# EAGLE design Motherboard_simple (EAGLE 6.3)
DATABASE: ./../../../eagle/PARTSDB.TXT
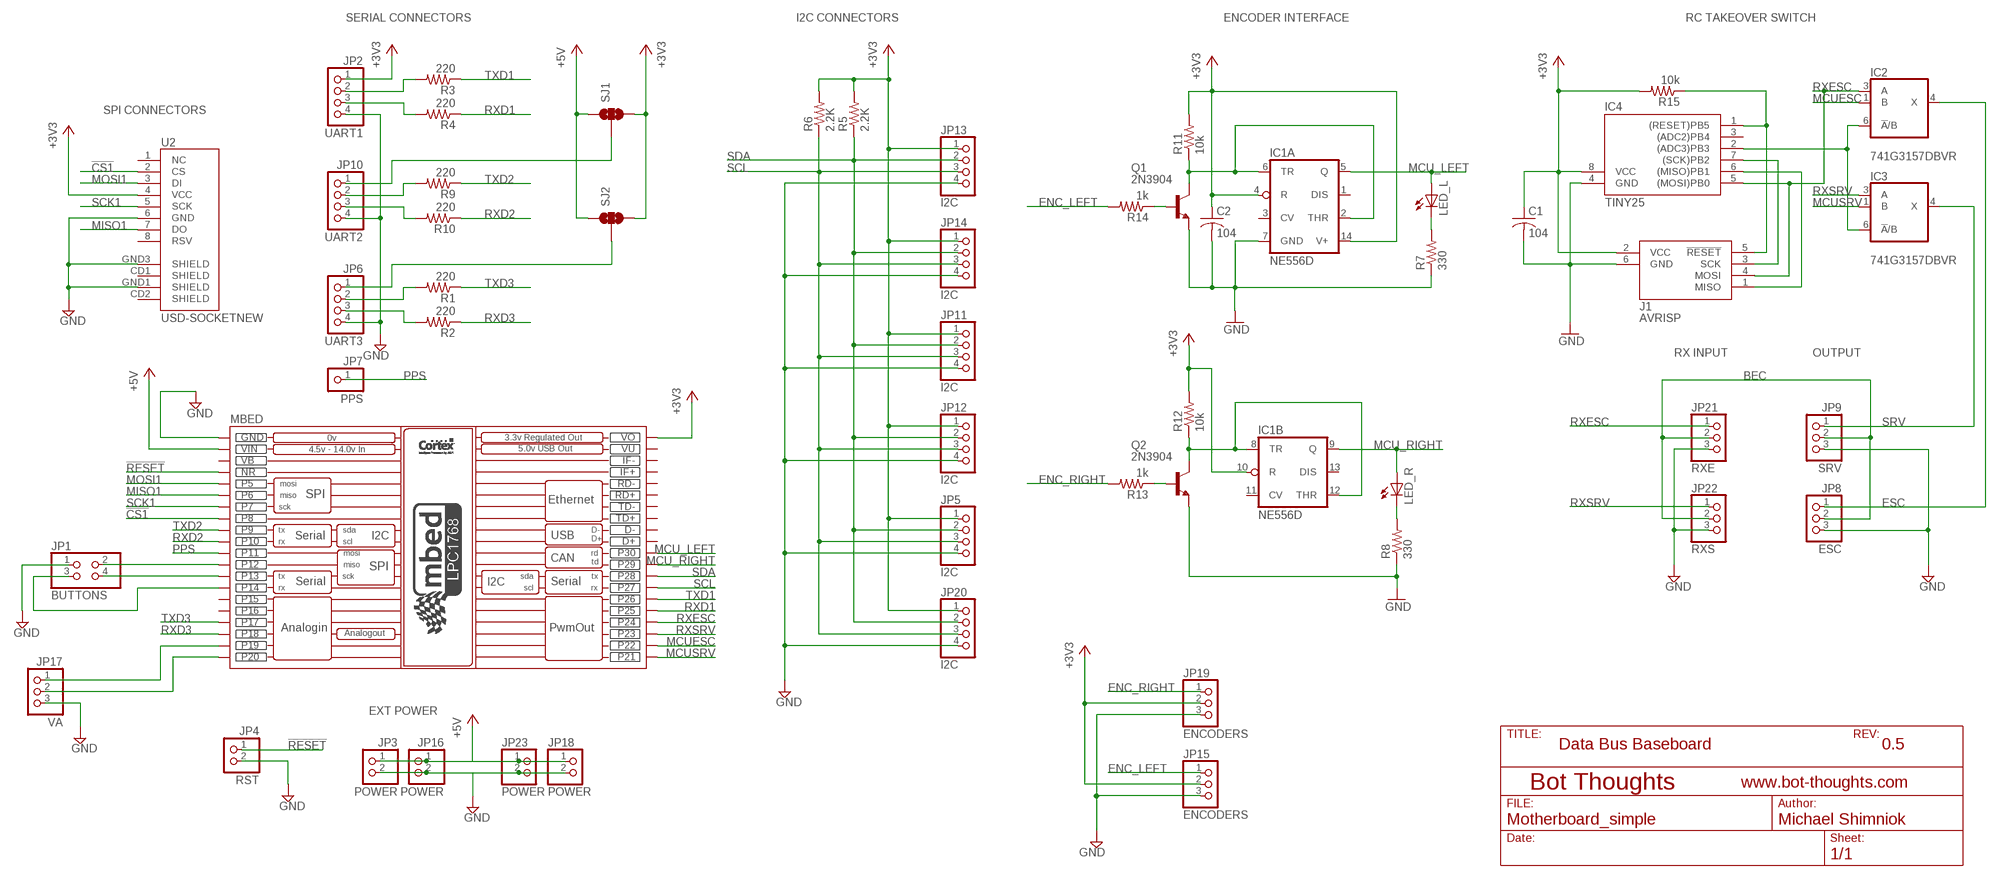
[diagram p0: schematic, sheet 1]

## Parts
C1  104  C-US050-025X075  [C050-025X075]
C2  104  C-US050-025X075  [C050-025X075]
IC1  NE556D  [SO14]
IC2  741G3157DBVR  [DBV_R-PDSO-G6]
IC3  741G3157DBVR  [DBV_R-PDSO-G6]
IC4  TINY25  TINY138P3  [DIL08]
J1  AVRISP  AVRISP6  [CON6P2R]
JP1  BUTTONS  PINHD-2X02_2.54  [2X02]
JP2  UART1  PINHD-1X04_2.54-S  [1X04-S]
JP3  POWER  PINHD-1X02_2.54-S  [1X02-S]
JP4  RST  PINHD-1X02_2.54-S  [1X02-S]
JP5  I2C  PINHD-1X04_2.54-S  [1X04-S]
JP6  UART3  PINHD-1X04_2.54-S  [1X04-S]
JP7  PPS  PINHD-1X01_2.54-S  [1X01-S]
JP8  ESC  PINHD-1X03_2.54-S  [1X03-S]
JP9  SRV  PINHD-1X03_2.54-S  [1X03-S]
JP10  UART2  PINHD-1X04_2.54-S  [1X04-S]
JP11  I2C  PINHD-1X04_2.54-S  [1X04-S]
JP12  I2C  PINHD-1X04_2.54-S  [1X04-S]
JP13  I2C  PINHD-1X04_2.54-S  [1X04-S]
JP14  I2C  PINHD-1X04_2.54-S  [1X04-S]
JP15  ENCODERS  PINHD-1X03_2.54-S  [1X03-S]
JP16  POWER  PINHD-1X02_2.54-S  [1X02-S]
JP17  VA  PINHD-1X03_2.54-S  [1X03-S]
JP18  POWER  PINHD-1X02_2.54-S  [1X02-S]
JP19  ENCODERS  PINHD-1X03_2.54-S  [1X03-S]
JP20  I2C  PINHD-1X04_2.54-S  [1X04-S]
JP21  RXE  PINHD-1X03_2.54-S  [1X03-S]
JP22  RXS  PINHD-1X03_2.54-S  [1X03-S]
JP23  POWER  PINHD-1X02_2.54-S  [1X02-S]
LED_L  LED3MM  [LED3MM]
LED_R  LED3MM  [LED3MM]
MBED  MBED_NXP_LPC1768  [MBED-KIT]
Q1  2N3904  [TO92]
Q2  2N3904  [TO92]
R1  220  R-US_0204/5  [0204/5]
R2  220  R-US_0204/5  [0204/5]
R3  220  R-US_0204/5  [0204/5]
R4  220  R-US_0204/5  [0204/5]
R5  2.2K  R-US_0204/5  [0204/5]
R6  2.2K  R-US_0204/5  [0204/5]
R7  330  R-US_0204/5  [0204/5]
R8  330  R-US_0204/5  [0204/5]
R9  220  R-US_0204/5  [0204/5]
R10  220  R-US_0204/5  [0204/5]
R11  10k  R-US_0204/5  [0204/5]
R12  10k  R-US_0204/5  [0204/5]
R13  1k  R-US_0204/5  [0204/5]
R14  1k  R-US_0204/5  [0204/5]
R15  10k  R-US_0204/5  [0204/5]
SJ1  SOLDERJUMPER_2WAYS  [SJ_3]
SJ2  SOLDERJUMPER_2WAYS  [SJ_3]
U2  USD-SOCKETNEW  [MICRO-SD-SOCKET-PP]

## Nets
!CS1: MBED.P$8(P8) U2.2(CS)
!RESET: JP4.1 MBED.NR
!TRST: IC4.1((RESET)PB5) J1.5(!RESET) R15.1
+3V3: C1.1 C2.1 IC1.4(A:R) IC1.10(B:R) IC1.14(A:V+) IC4.8(VCC) J1.2(VCC) JP2.1 JP5.1 JP11.1 JP12.1 JP13.1 JP14.1 JP15.2 JP19.2 JP20.1 MBED.VOUT(VO) R5.2 R6.2 R11.2 R12.2 R15.2 SJ1.3 SJ2.3 U2.4(VCC)
+5V: JP3.1 JP16.1 JP18.1 JP23.1 MBED.VIN SJ1.1 SJ2.1
AMP: JP17.2 MBED.P$20(P20)
BEC: JP8.2 JP9.2 JP21.2 JP22.2
ENC_LEFT: JP15.1 R14.2
ENC_RIGHT: JP19.1 R13.2
ESC: IC2.4(X) JP8.1
GND: C1.2 C2.2 IC1.7(A:GND) IC4.4(GND) J1.6(GND) JP1.1 JP2.4 JP3.2 JP4.2 JP5.4 JP6.4 JP8.3 JP9.3 JP10.4 JP11.4 JP12.4 JP13.4 JP14.4 JP15.3 JP16.2 JP17.3 JP18.2 JP19.3 JP20.4 JP21.3 JP22.3 JP23.2 MBED.GND Q1.3(E) Q2.3(E) R7.1 R8.1 U2.6(GND) U2.GND1(SHIELD) U2.GND3(SHIELD)
MCU_LEFT: IC1.5(A:Q) LED_L.A MBED.P$30(P30)
MCU_RIGHT: IC1.9(B:Q) LED_R.A MBED.P$29(P29)
MCUESC: IC2.1(B) MBED.P$22(P22)
MCUSRV: IC3.1(B) MBED.P$21(P21)
MISO: IC4.6((MISO)PB1) J1.1(MISO)
MISO1: MBED.P$6(P6) U2.7(DO)
MOSI1: MBED.P$5(P5) U2.3(DI)
N$1: JP6.2 R1.2
N$2: JP6.3 R2.2
N$3: LED_L.K(C) R7.2
N$4: LED_R.K(C) R8.2
N$5: JP1.4 MBED.P$13(P13)
N$6: JP17.1 MBED.P$19(P19)
N$7: JP1.2 MBED.P$12(P12)
N$8: JP1.3 MBED.P$14(P14)
N$9: JP2.2 R3.2
N$10: JP2.3 R4.2
N$11: IC1.8(B:TR) IC1.12(B:THR) Q2.1(C) R12.1
N$12: IC1.2(A:THR) IC1.6(A:TR) Q1.1(C) R11.1
N$13: Q2.2(B) R13.1
N$14: Q1.2(B) R14.1
N$16: JP10.2 R9.2
N$17: JP10.3 R10.2
N$18: JP10.1 SJ1.2
N$19: JP6.1 SJ2.2
N$25: IC2.6(!A!/B) IC3.6(!A!/B) IC4.2((ADC3)PB3)
PPS: JP7.1 MBED.P$11(P11)
RXD1: MBED.P$25(P25) R4.1
RXD2: MBED.P$10(P10) R10.1
RXD3: MBED.P$18(P18) R2.1
RXESC: IC2.3(A) IC4.5((MOSI)PB0) J1.4(MOSI) JP21.1 MBED.P$24(P24)
RXSRV: IC3.3(A) JP22.1 MBED.P$23(P23)
SCK: IC4.7((SCK)PB2) J1.3(SCK)
SCK1: MBED.P$7(P7) U2.5(SCK)
SCL: JP5.3 JP11.3 JP12.3 JP13.3 JP14.3 JP20.3 MBED.P$27(P27) R6.1
SDA: JP5.2 JP11.2 JP12.2 JP13.2 JP14.2 JP20.2 MBED.P$28(P28) R5.1
SRV: IC3.4(X) JP9.1
TXD1: MBED.P$26(P26) R3.1
TXD2: MBED.P$9(P9) R9.1
TXD3: MBED.P$17(P17) R1.1
Unconnected: IC1.1(A:DIS) IC1.3(A:CV) IC1.11(B:CV) IC1.13(B:DIS) IC4.3((ADC2)PB4) MBED.D+ MBED.D- MBED.IF+ MBED.IF- MBED.P$15(P15) MBED.P$16(P16) MBED.RD+ MBED.RD- MBED.TD+ MBED.TD- U2.1(NC) U2.8(RSV) U2.CD1(SHIELD) U2.CD2(SHIELD)

## Notes on the sheet
- SERIAL CONNECTORS | I2C CONNECTORS | ENCODER INTERFACE | RC TAKEOVER SWITCH
- SPI CONNECTORS
- RX INPUT | OUTPUT
- EXT POWER
- Data Bus Baseboard | 0.5

## Power pins joined to a net without a drawn wire
GND: IC2.2(GND) IC3.2(GND)
VB: MBED.VB
VCC: IC2.5(VCC) IC3.5(VCC)
VU: MBED.VU

## Library data of the parts
C1 C2 = rcl:C-US: CAPACITOR, American symbol
IC1 = linear:*556: Dual TIMER
IC2 IC3 = 74xx-little-us:74*1G3157: Single-Pole, Double-Throw Analog Switch Source: http://focus.ti.com/lit/ds/symlink/sn74lvc1g3157.pdf
IC4 = avr-7:TINY13*
J1 = ads4:AVRISP6: 6-pin dual-row connector for Atmel AVRISP programmer interface
JP1 = pinhead-2:PINHD-2X02: PIN HEADER
JP2 JP5 JP6 JP10-JP14 JP20 = pinhead-2:PINHD-1X04: PIN HEADER; OC_NEWARK: unknown
JP3 JP4 JP16 JP18 JP23 = pinhead-2:PINHD-1X02: PIN HEADER; OC_NEWARK: unknown
JP7 = pinhead-2:PINHD-1X01: PIN HEADER
JP8 JP9 JP15 JP17 JP19 JP21 JP22 = pinhead-2:PINHD-1X03: PIN HEADER; OC_NEWARK: unknown
LED_L LED_R = led:LED: LED OSRAM: - CHIPLED LG R971, LG N971, LY N971, LG Q971, LY Q971, LO R971, LY R971 LH N974, LH R974 LS Q976, LO Q976, LY Q976 LO Q996 - Hyper CHIPLED LW Q18S LB Q993, LB Q99A, LB R99A - SideLED LS A670, LO A670, LY A670, LG A670, LP A670 LB A673, LV A673, LT A673, LW A673 LH A674 LY A675 LS A676, LA A676, LO A676, LY A676, LW A676 LS A679, LY A679, LG A679 - Hyper Micro SIDELED® LS Y876, LA Y876, LO Y876, LY Y876 LT Y87S - SmartLED LW L88C, LW L88S LB L89C, LB L89S, LG L890 LS L89K, LO L89K, LY L89K LS L896, LA L896, LO L896, LY L896 - TOPLED LS T670, LO T670, LY T670, LG T670, LP T670 LSG T670, LSP T670, LSY T670, LOP T670, LYG T670 LG T671, LOG T671, LSG T671 LB T673, LV T673, LT T673, LW T673 LH T674 LS T676, LA T676, LO T676, LY T676, LB T676, LH T676, LSB T676, LW T676 LB T67C, LV T67C, LT T67C, LS T67K, LO T67K, LY T67K, LW E67C LS E67B, LA E67B, LO E67B, LY E67B, LB E67C, LV E67C, LT E67C LW T67C LS T679, LY T679, LG T679 LS T770, LO T770, LY T770, LG T770, LP T770 LB T773, LV T773, LT T773, LW T773 LH T774 LS E675, LA E675, LY E675, LS T675 LS T776, LA T776, LO T776, LY T776, LB T776 LHGB T686 LT T68C, LB T68C - Hyper Mini TOPLED® LB M676 - Mini TOPLED Santana® LG M470 LS M47K, LO M47K, LY M47K Source: http://www.osram.convergy.de LUXEON: - LUMILED® LXK2-PW12-R00, LXK2-PW12-S00, LXK2-PW14-U00, LXK2-PW14-V00 LXK2-PM12-R00, LXK2-PM12-S00, LXK2-PM14-U00 LXK2-PE12-Q00, LXK2-PE12-R00, LXK2-PE12-S00, LXK2-PE14-T00, LXK2-PE14-U00 LXK2-PB12-K00, LXK2-PB12-L00, LXK2-PB12-M00, LXK2-PB14-N00, LXK2-PB14-P00, LXK2-PB14-Q00 LXK2-PR12-L00, LXK2-PR12-M00, LXK2-PR14-Q00, LXK2-PR14-R00 LXK2-PD12-Q00, LXK2-PD12-R00, LXK2-PD12-S00 LXK2-PH12-R00, LXK2-PH12-S00 LXK2-PL12-P00, LXK2-PL12-Q00, LXK2-PL12-R00 Source: www.luxeon.com KINGBRIGHT: KA-3528ASYC Source: www.kingbright.com
MBED = MBED_v2.1:MBED_NXP_LPC1768: Mbed LPC1768 - ARM CORTEX v2.1 * Schematic symbol is now placed in eagles's default raster. *The pads diameter are suitable for routing between mbed pins * mbed pads are 0.8 mm drill diameter. --------------------------------------------- Created by: Mohamed Yousry *Alexandria, Egypt *Email: mohamed.yousry@ieeegoldegypt.org; MPN: 2212S-20SG-85; OC_NEWARK: 08N6778
Q1 Q2 = mes_transistors:2N3904: NPN Transistor Small signal NPN Bipolar Junction Transistor (BJT). Use this device to represent any of a number of such transistors with similar package and pinout: 2N4401, 2N3904, 2N2222, etc.
R1-R4 R9 R10 = rcl:R-US_: RESISTOR, American symbol; MPN: WCR0805-220RFI; OC_NEWARK: 98K2621
R5 R6 = rcl:R-US_: RESISTOR, American symbol; OC_NEWARK: unknown
R7 R8 R11-R15 = rcl:R-US_: RESISTOR, American symbol
SJ1 SJ2 = SparkFun:SOLDERJUMPER_2WAY: Solder Jumper 2 way solder jumper
U2 = SparkFun:USD-SOCKET: microSD Socket Push-push type uSD socket. Schematic element and footprint production proven. Spark Fun Electronics SKU : PRT-00127. tDoc lines correctly indicate media card edge positions when inserting (unlocked, locked, depressed).

## Board
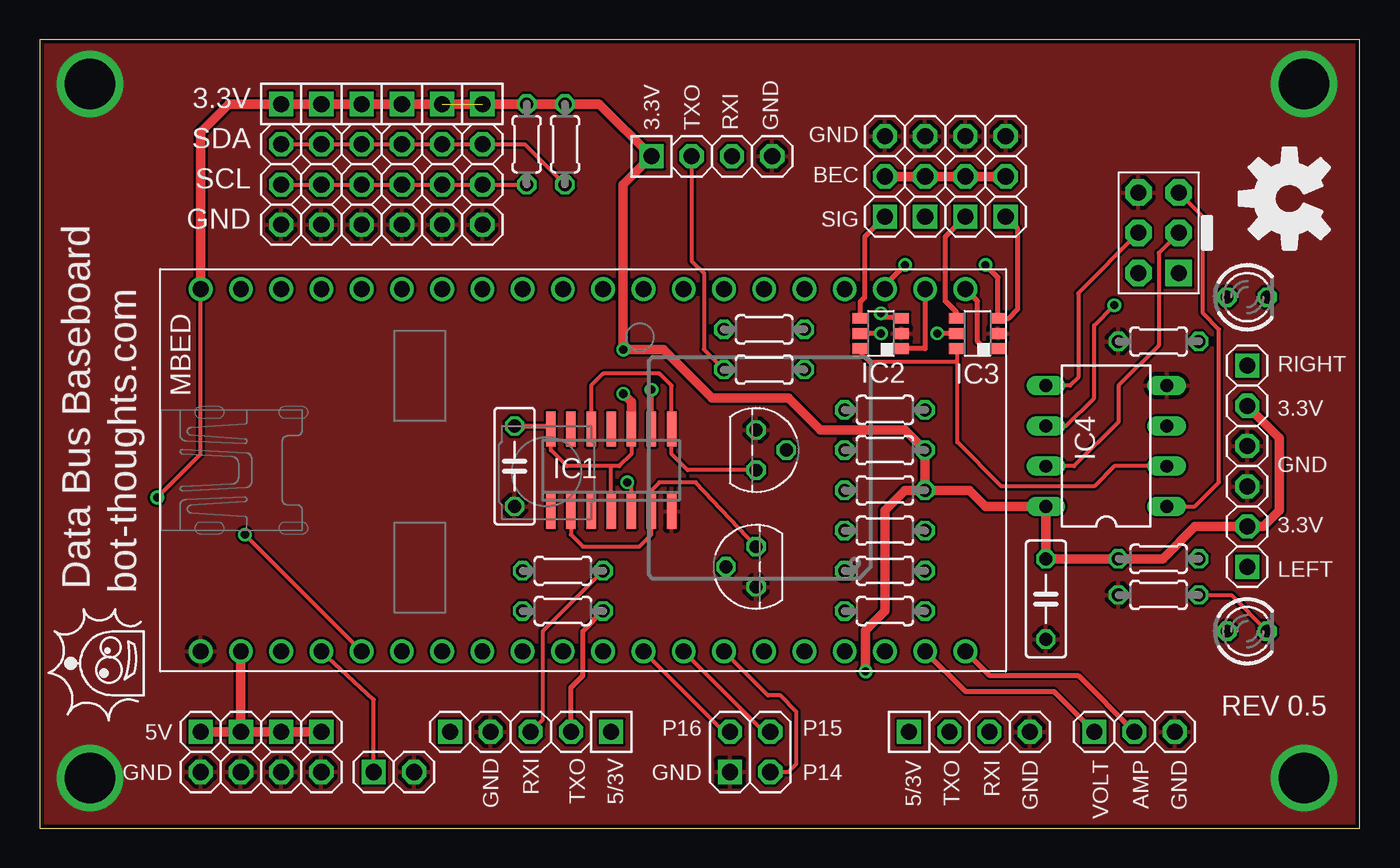
[diagram p1: board, top side]
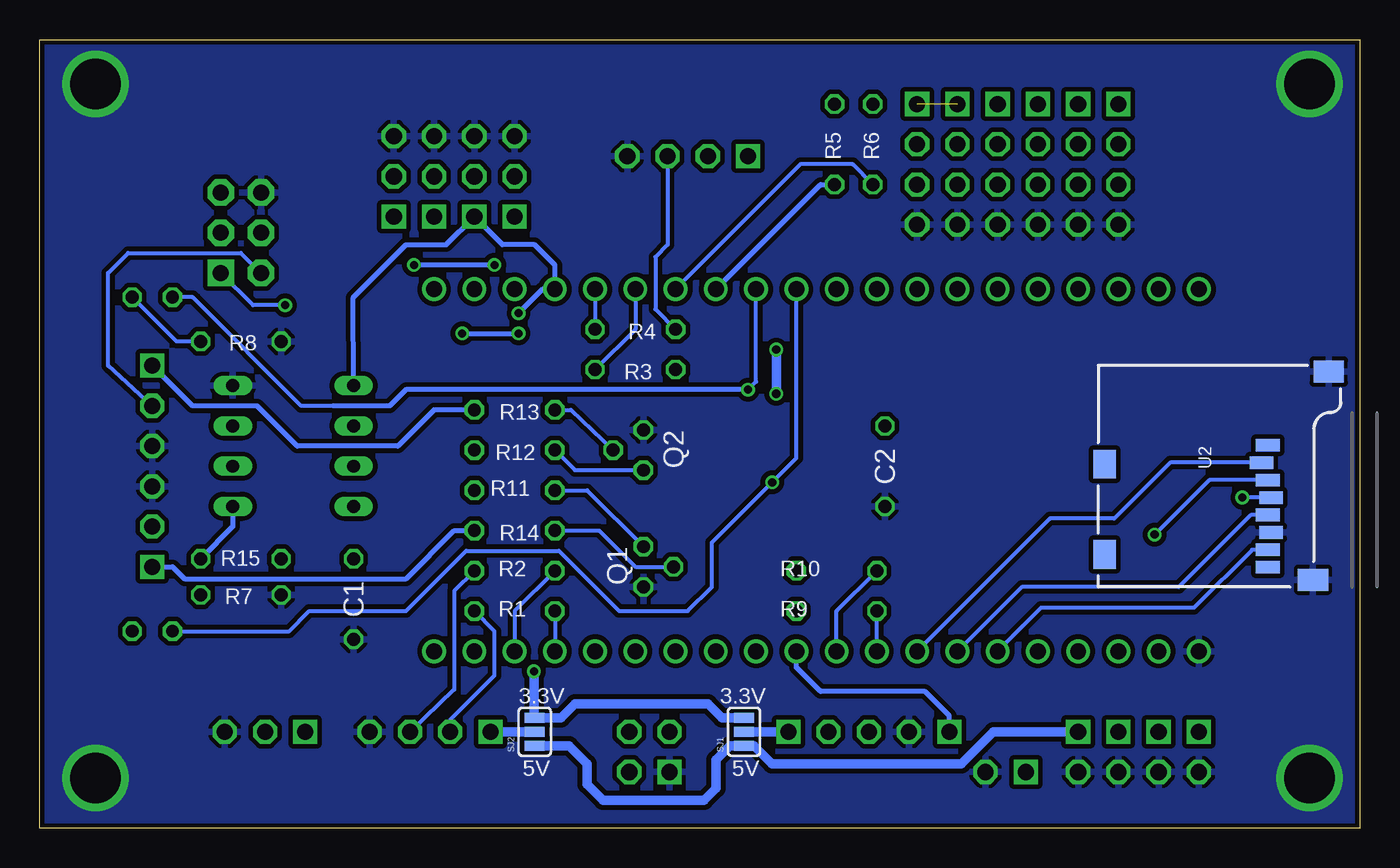
[diagram p2: board, bottom side, seen from below]

Size 83.31 x 49.78 mm. Coordinates in mm from the lower left corner, seen from the top.
Outline: 0,0 83.31,0 83.31,49.78 0,49.78 0,0
Copper layers (1*16): Top 0.0356mm / dielectric 1.5011mm / Bottom 0.0356mm
Design rules "default *": minimum track width 6mil, minimum drill 13mil, track to track 6mil, track to pad 6mil, pad to pad 6mil, via to via 6mil, smd to smd 6mil, copper to edge 10mil, drill to drill 6mil, minimum pad ring 7mil, minimum via ring 7mil, stop-mask expansion 4mil, vias tented up to drill 21mil, thermal gap 10mil

### Footprints (pad centres in the part's own frame; a part is rotated, then mirrored left to right if it is on the bottom)
C050-025X075 = drill 0.813 octagon: 1 -2.54,0; 2 2.54,0
SO14 = smd 0.6 x 2.2: 1 -3.81,-2.6; 2 -2.54,-2.6; 3 -1.27,-2.6; 4 0,-2.6; 5 1.27,-2.6; 6 2.54,-2.6; 7 3.81,-2.6; 8 3.81,2.6; 9 2.54,2.6; 10 1.27,2.6; 11 0,2.6; 12 -1.27,2.6; 13 -2.54,2.6; 14 -3.81,2.6
DBV_R-PDSO-G6 = smd 0.69 x 0.99: 1 -0.95,-1.29; 2 0,-1.29; 3 0.95,-1.29; 4 0.95,1.3; 5 0,1.3; 6 -0.95,1.3
DIL08 = drill 0.813 long: 1 -3.81,-3.81; 2 -1.27,-3.81; 3 1.27,-3.81; 4 3.81,-3.81; 5 3.81,3.81; 6 1.27,3.81; 7 -1.27,3.81; 8 -3.81,3.81
CON6P2R = drill 1.016 pad 1.676 square: 1 -2.54,-1.27 | drill 1.016 pad 1.676 octagon: 2 -2.54,1.27; 3 0,-1.27; 4 0,1.27; 5 2.54,-1.27; 6 2.54,1.27
2X02 = drill 1.016 square: 1 -1.27,-1.27 | drill 1.016 octagon: 2 -1.27,1.27; 3 1.27,-1.27; 4 1.27,1.27
1X04-S = drill 1.016 square: 1 -3.81,0 | drill 1.016 octagon: 2 -1.27,0; 3 1.27,0; 4 3.81,0
1X02-S = drill 1.016 square: 1 -1.27,0 | drill 1.016 octagon: 2 1.27,0
1X01-S = drill 1.016 square: 1 0,0
1X03-S = drill 1.016 square: 1 -2.54,0 | drill 1.016 octagon: 2 0,0; 3 2.54,0
LED3MM = drill 0.813 octagon: A -1.27,0; K 1.27,0
MBED-KIT = drill 1: D+ 11.43,1.27; D- 11.43,3.81; GND -11.43,24.13; IF+ 11.43,16.51; IF- 11.43,19.05; NR -11.43,16.51; P$5 -11.43,13.97; P$6 -11.43,11.43; P$7 -11.43,8.89; P$8 -11.43,6.35; P$9 -11.43,3.81; P$10 -11.43,1.27; P$11 -11.43,-1.27; P$12 -11.43,-3.81; P$13 -11.43,-6.35; P$14 -11.43,-8.89; P$15 -11.43,-11.43; P$16 -11.43,-13.97; P$17 -11.43,-16.51; P$18 -11.43,-19.05; P$19 -11.43,-21.59; P$20 -11.43,-24.13; P$21 11.43,-24.13; P$22 11.43,-21.59; P$23 11.43,-19.05; P$24 11.43,-16.51; P$25 11.43,-13.97; P$26 11.43,-11.43; P$27 11.43,-8.89; P$28 11.43,-6.35; P$29 11.43,-3.81; P$30 11.43,-1.27; RD+ 11.43,11.43; RD- 11.43,13.97; TD+ 11.43,6.35; TD- 11.43,8.89; VB -11.43,19.05; VIN -11.43,21.59; VOUT 11.43,24.13; VU 11.43,21.59
TO92 = drill 0.813 octagon: 1 1.27,0; 2 0,1.905; 3 -1.27,0
0204/5 = drill 0.813 octagon: 1 -2.54,0; 2 2.54,0
SJ_3 = smd 0.635 x 1.27: 1 -0.889,0; 2 0,0; 3 0.889,0
MICRO-SD-SOCKET-PP = smd 0.8 x 1.5: 1 -8.94,10.7; 2 -7.84,10.3; 3 -6.74,10.7; 4 -5.64,10.9; 5 -4.54,10.7; 6 -3.44,10.9; 7 -2.34,10.7; 8 -1.24,10.7 | smd 1.8 x 1.4: CD1 -2.05,0.4; CD2 -7.75,0.4 | smd 1.4 x 1.9: GND1 -13.6,14.55; GND3 -0.45,13.55

### Placement (x,y rotation side)
C1  63.5,14.48 270 top
C2  29.97,22.86 270 top
IC1  36.07,22.61 0 top
IC2  53.09,31.24 90 top
IC3  59.18,31.24 90 top
IC4  67.31,24.13 90 top
J1  70.61,37.59 90 top
JP1  44.83,4.83 0 top
JP2  42.42,42.42 0 top
JP3  15.24,4.83 270 top
JP4  22.35,3.56 0 top
JP5  25.4,41.91 270 top
JP6  58.67,6.1 0 top
JP7  25.91,6.1 270 top
JP8  53.34,41.15 90 top
JP9  58.42,41.15 90 top
JP10  32.26,6.1 180 top
JP11  20.32,41.91 270 top
JP12  15.24,41.91 270 top
JP13  22.86,41.91 270 top
JP14  17.78,41.91 270 top
JP15  76.2,19.05 90 top
JP16  12.7,4.83 270 top
JP17  69.09,6.1 0 top
JP18  10.16,4.83 270 top
JP19  76.2,26.67 270 top
JP20  27.94,41.91 270 top
JP21  55.88,41.15 90 top
JP22  60.96,41.15 90 top
JP23  17.78,4.83 270 top
LED_L  76.2,12.45 0 top
LED_R  76.2,33.53 0 top
MBED  34.29,22.61 90 top
Q1  45.21,16.51 90 top
Q2  45.21,23.88 270 top
R1  53.34,13.72 0 top
R2  53.34,16.26 0 top
R3  45.72,28.96 180 top
R4  45.72,31.5 180 top
R5  33.15,43.18 90 top
R6  30.73,43.18 90 top
R7  70.61,14.73 0 top
R8  70.61,30.73 0 top
R9  33.02,13.72 0 top
R10  33.02,16.26 0 top
R11  53.34,21.34 0 top
R12  53.34,23.88 0 top
R13  53.34,26.42 0 top
R14  53.34,18.8 0 top
R15  70.61,17.02 180 top
SJ1  38.86,6.1 90 bottom
SJ2  52.07,6.1 90 bottom
U2  16.51,15.24 270 bottom

### Tracks (layer width: path | path; a pad name or v marks a point on that pad's centre or on a via)
!CS1
  Bottom 0.254: U2.2 11.97,23.08 15.49,19.56 19.56,19.56 MBED.P$8
!RESET
  Top 0.254: JP4.1 21.08,8.13 MBED.NR
!TRST
  Top 0.254: IC4.1 72.9,20.32 74.42,21.84 74.42,31.5 73.41,32.51 73.41,38.61 J1.5
  Bottom 0.305: IC4.1 71.12,19.05 R15.1
+3V3  (via drill 0.51)  (1 unrouted)
  Top 0.254: v7.42,20.88 10.16,23.62 MBED.VOUT | IC1.4 36.07,22.86 | 36.07,22.86 33.27,22.86 32.26,23.88 IC1.14 | IC1.10 37.34,23.62 36.58,22.86 36.07,22.86
  Top 0.305: C2.1 32.06,25.4 IC1.14
  Top 0.61: MBED.VOUT 10.16,43.94 11.94,45.72 JP12.1 JP14.1 JP11.1 JP13.1 JP5.1 R6.2 R5.2 35.31,45.72 JP2.1 36.83,40.64 v36.83,30.23 39.37,30.23 42.42,27.18 47.24,27.18 49.28,25.15 54.61,25.15 R12.2 R11.2 | R11.2 54.61,21.34 53.34,20.07 53.34,13.72 52.12,12.5 v52.12,9.91 | IC1.10 37.34,26.92 v36.83,27.43 | R11.2 58.67,21.34 59.69,20.32 IC4.8 C1.1 R15.2 70.87,17.02 72.9,19.05 JP15.2 77.22,19.05 78.23,20.07 78.23,24.64 JP19.2
  Bottom 0.254: U2.4 v7.42,20.88 | JP19.2 78.99,29.21 78.99,35.05 77.72,36.32 70.61,36.32 J1.2
  Bottom 0.61: v36.83,27.43 v36.83,30.23 | SJ1.3 40.26,6.99 41.15,7.87 49.53,7.87 50.42,6.99 SJ2.3 | SJ2.3 51.94,6.99 | v52.12,9.91 52.12,7.04 SJ2.3
+5V
  Top 0.61: JP16.1 MBED.VIN | JP16.1 JP3.1 JP23.1 | JP16.1 JP18.1
  Bottom 0.61: SJ2.1 49.91,5.21 48.77,4.06 48.77,2.79 47.75,1.78 41.4,1.78 40.64,2.54 40.64,4.32 39.75,5.21 SJ1.1 38.23,5.21 37.08,4.06 25.15,4.06 23.11,6.1 JP23.1
AMP
  Top 0.305: MBED.P$20 59.94,9.65 65.53,9.65 JP17.2
BEC
  Top 0.61: JP8.2 JP21.2 JP9.2 JP22.2
ENC_LEFT
  Bottom 0.305: JP15.1 74.93,16.51 74.17,15.75 60.2,15.75 57.15,18.8 R14.2
ENC_RIGHT
  Bottom 0.305: R13.2 58.42,26.42 60.71,24.13 67.06,24.13 69.6,26.67 73.66,26.67 JP19.1
ESC
  Top 0.305: IC2.4 51.79,33.24 52.07,33.53 52.07,37.34 JP8.1
GND  (via drill 3.17)
  other vias: 3.17,46.99 3.17,3.17 79.78,3.17 79.78,46.99
  pour Bottom (isolate 0.305, rank 3): 0,49.91 83.34,49.91 83.34,0 0,0
  pour Top: 0,50.04 83.31,50.04 83.31,0 0,0
MCU_LEFT  (via drill 0.51)
  Top 0.254: IC1.5 37.34,21.59 v37.08,21.84
  Bottom 0.254: MBED.P$30 35.56,23.37 v37.08,21.84 40.89,18.03 40.89,15.24 42.42,13.72 46.74,13.72 50.55,17.53 56.39,17.53 60.2,13.72 66.29,13.72 67.56,12.45 LED_L.A
MCU_RIGHT  (via drill 0.51)
  Top 0.254: v38.61,27.69 IC1.9
  Bottom 0.254: v38.61,27.69 38.1,28.19 MBED.P$29 | 64.77,26.67 66.8,26.67 73.66,33.53 LED_R.A
  Bottom 0.305: v38.61,27.69 60.2,27.69 61.21,26.67 64.77,26.67
MCUESC
  Top 0.305: MBED.P$22 55.88,30.27 IC2.1
MCUSRV
  Top 0.305: IC3.1 59.62,30.29 59.18,30.73 59.18,33.27 MBED.P$21
MISO  (via drill 0.51)
  Top 0.254: IC4.6 64.77,25.4 66.55,27.18 66.55,31.75 v67.82,33.02
  Bottom 0.254: v67.82,33.02 69.85,33.02 J1.1
MISO1
  Bottom 0.254: U2.7 6.8,17.58 10.47,13.92 20.12,13.92 MBED.P$6
MOSI1  (via drill 0.51)
  Top 0.254: v12.95,18.54 MBED.P$5
  Bottom 0.254: U2.3 9.52,21.98 v12.95,18.54
N$1
  Bottom 0.254: JP6.2 57.4,6.86 54.61,9.65 54.61,12.45 R1.2
N$2
  Bottom 0.254: R2.2 57.15,14.99 57.15,8.76 JP6.3
N$3
  Top 0.254: R7.2 75.18,14.73 LED_L.K
N$4
  Bottom 0.254: R8.2 74.68,30.73 LED_R.K
N$5
  Top 0.254: JP1.4 45.72,6.1 MBED.P$13
N$6
  Top 0.305: MBED.P$19 58.42,8.64 64.01,8.64 JP17.1
N$7
  Top 0.254: JP1.2 43.18,6.1 MBED.P$12
N$8
  Top 0.254: JP1.3 47.24,3.56 47.75,4.06 47.75,7.37 46.74,8.38 45.97,8.38 MBED.P$14
N$9
  Top 0.254: JP2.2 41.15,35.81 41.91,35.05 41.91,30.23 R3.2
N$10
  Bottom 0.254: JP2.3 43.69,36.83 44.45,36.07 44.45,32.77 R4.2
N$11
  Top 0.254: Q2.1 40.89,22.61 39.88,23.62 IC1.8 39.88,27.94 39.12,28.7 35.56,28.7 34.8,27.94 IC1.12
  Bottom 0.254: R12.1 49.53,22.61 Q2.1
N$12
  Top 0.254: Q1.1 41.4,21.84 39.12,21.84 38.61,21.34 IC1.6 38.61,18.54 37.85,17.78 34.29,17.78 33.53,18.54 IC1.2
  Bottom 0.254: R11.1 48.77,21.34 Q1.1
N$13
  Bottom 0.254: R13.1 49.78,26.42 Q2.2
N$14
  Bottom 0.254: R14.1 48.01,18.8 45.72,16.51 Q1.2
N$16
  Top 0.305: JP10.2 33.53,8.89 34.29,9.65 34.29,12.45 R9.2
N$17
  Top 0.254: R10.2 31.75,12.45 31.75,6.86 JP10.3
N$18
  Bottom 0.61: SJ1.2 JP10.1
N$19
  Bottom 0.61: SJ2.2 JP6.1
N$25
  Top 0.254: IC4.2 67.82,22.86 66.55,21.59 60.71,21.59 57.91,24.38 57.91,29.46 | 57.91,29.46 57.91,30.26 IC3.6 | IC2.6 51.79,30 52.32,29.46 57.91,29.46
PPS
  Bottom 0.305: JP7.1 25.91,7.11 27.43,8.64 34.04,8.64 35.56,10.16 MBED.P$11
RXD1
  Bottom 0.254: MBED.P$25 R4.1
RXD2
  Bottom 0.254: MBED.P$10 33.02,13.72 R10.1
RXD3
  Bottom 0.254: R2.1 53.34,13.72 MBED.P$18
RXESC  (via drill 0.51)
  Top 0.254: J1.4 65.53,33.78 65.53,28.45 65.02,27.94 IC4.5
  Top 0.305: v53.09,32.51 53.34,32.26 54.31,32.26 IC2.3
  Bottom 0.305: v53.09,32.51 51.56,34.04 MBED.P$24 50.8,35.56 52.07,36.83 54.1,36.83 JP21.1 57.66,36.83 60.2,36.83 63.53,33.5 IC4.5
RXSRV  (via drill 0.51)
  Top 0.305: JP22.1 61.72,37.85 61.72,32.77 61.15,32.19 IC3.3 60.47,34.78 v59.69,35.56 | MBED.P$23 53.34,34.29 v54.61,35.56
  Bottom 0.305: v54.61,35.56 v59.69,35.56
SCK
  Top 0.254: J1.3 70.61,36.32 70.61,30.48 68.07,27.94 68.07,25.65 65.28,22.86 IC4.7
SCK1
  Bottom 0.254: U2.5 6.89,19.78 11.43,15.24 21.34,15.24 MBED.P$7
SCL
  Top 0.254: JP12.3 JP14.3 JP11.3 JP13.3 JP5.3 JP20.3 R6.1
  Bottom 0.254: R6.1 32,41.91 35.31,41.91 MBED.P$27
SDA
  Top 0.254: JP12.2 JP14.2 JP11.2 JP13.2 JP5.2 JP20.2 30.61,43.18 R5.1
  Bottom 0.305: MBED.P$28 34.04,40.64 R5.1
SRV
  Top 0.305: IC3.4 57.88,32.54 57.15,33.27 57.15,37.34 JP9.1
TXD1
  Bottom 0.254: MBED.P$26 45.72,31.5 R3.1
TXD2
  Bottom 0.254: MBED.P$9 R9.1
TXD3
  Bottom 0.254: R1.1 MBED.P$17
VCC  (via drill 0.51)
  Top 0.305: IC3.5 v56.64,31.24 | v53.09,31.24 IC2.5
  Bottom 0.305: v56.64,31.24 v53.09,31.24

### Text on the board
bPlace: 3.3V | 3.3V | 5V | 5V
tNames: 3.3V | SDA | 3.3V | TXO | RXI | GND | GND | SCL | BEC | GND | SIG | RIGHT | 3.3V | GND | 3.3V | LEFT | Data Bus Baseboard | bot-thoughts.com | 5V | P16 | REV 0.5 | P15 | GND | GND | RXI | TXO | 5/3V | GND | 5/3V | TXO | RXI | GND | VOLT | AMP | GND | P14
tDocu: Yes, this is backwards; fix when mounting